# EAGLE schematic torque_sensor (EAGLE 9.5.2)
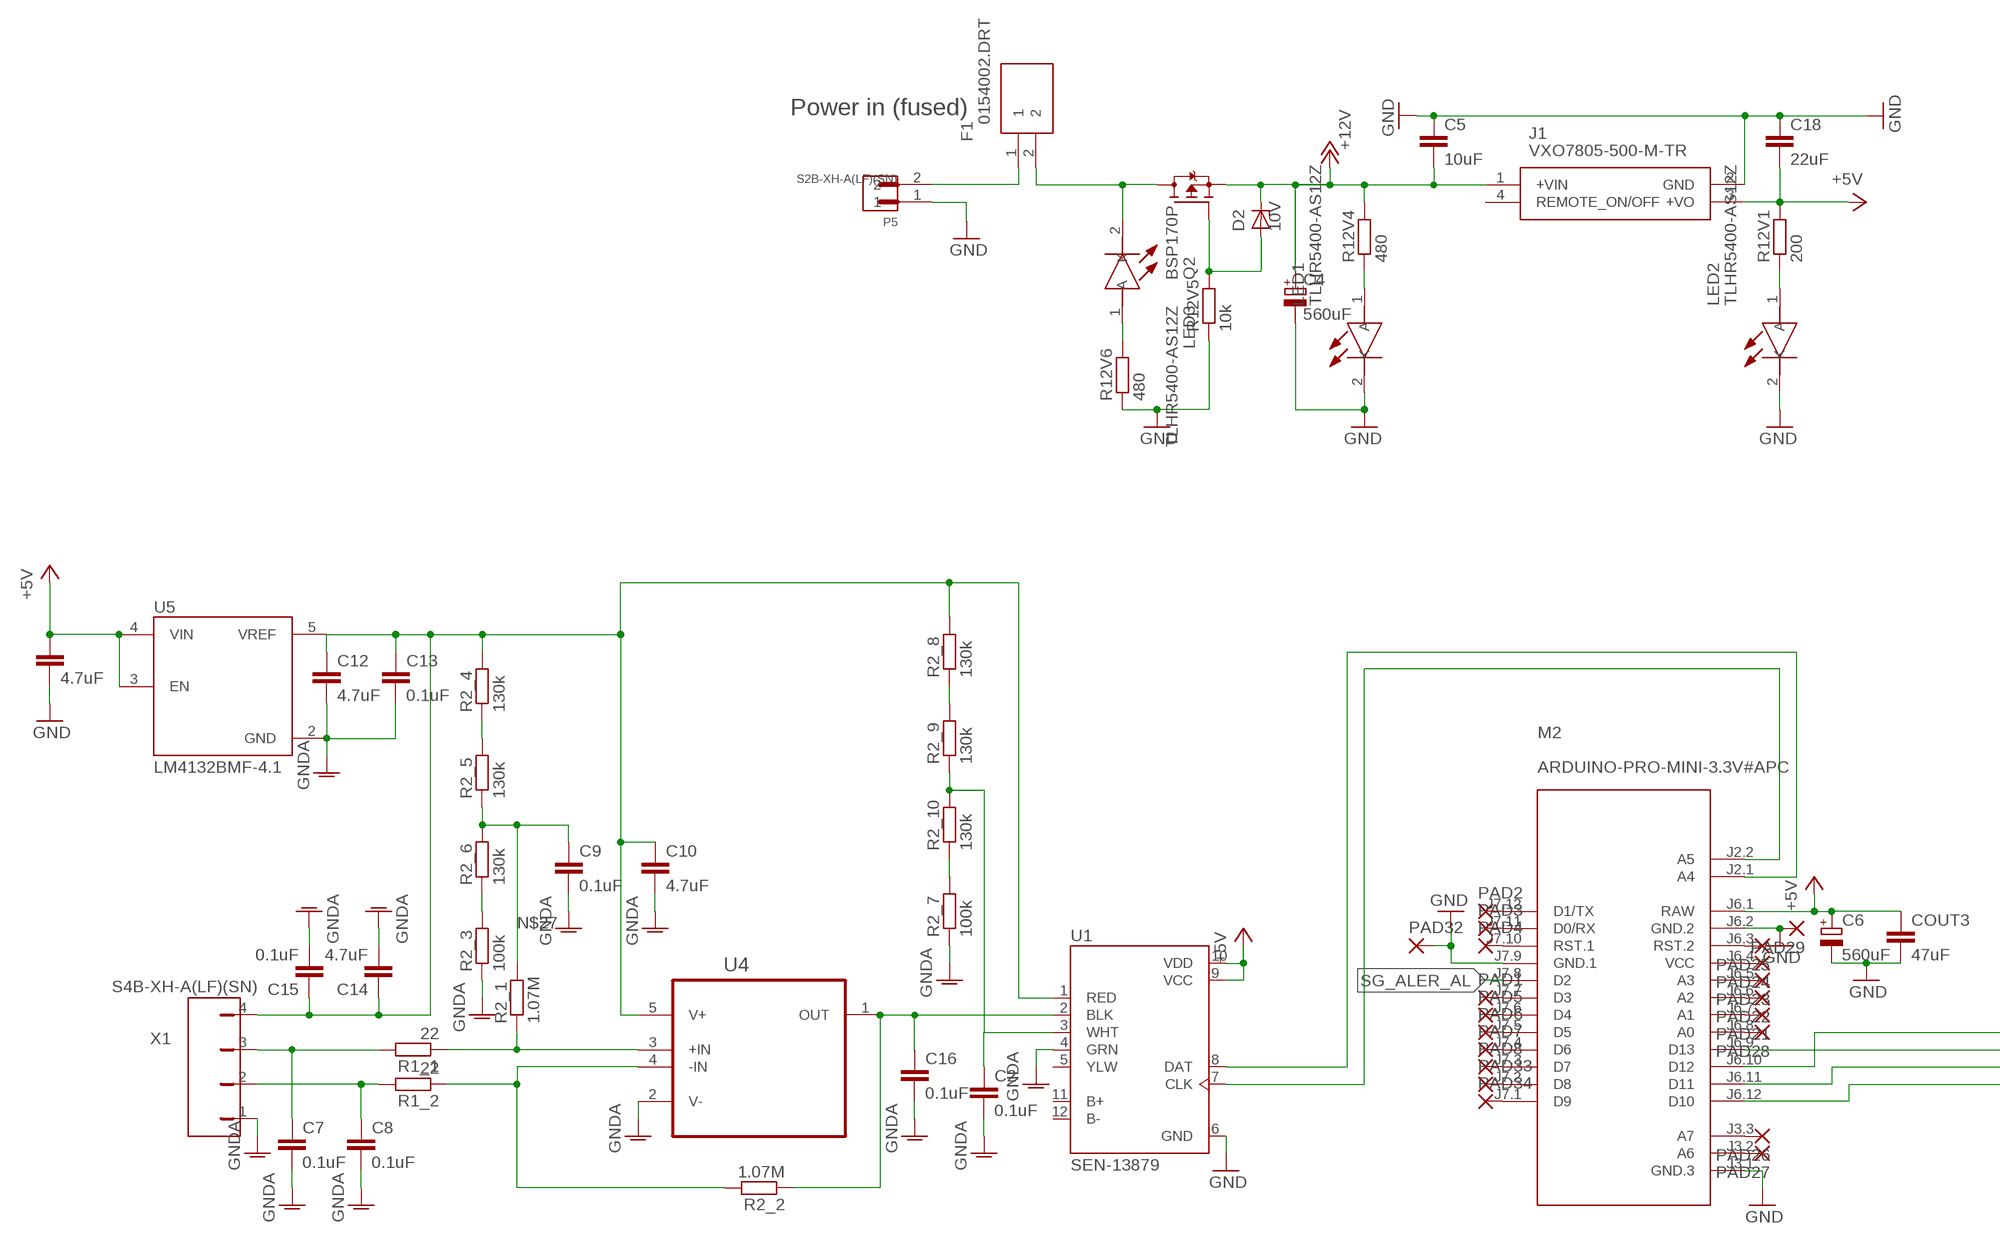
[diagram p0: schematic, sheet 1, part 1 of 2]
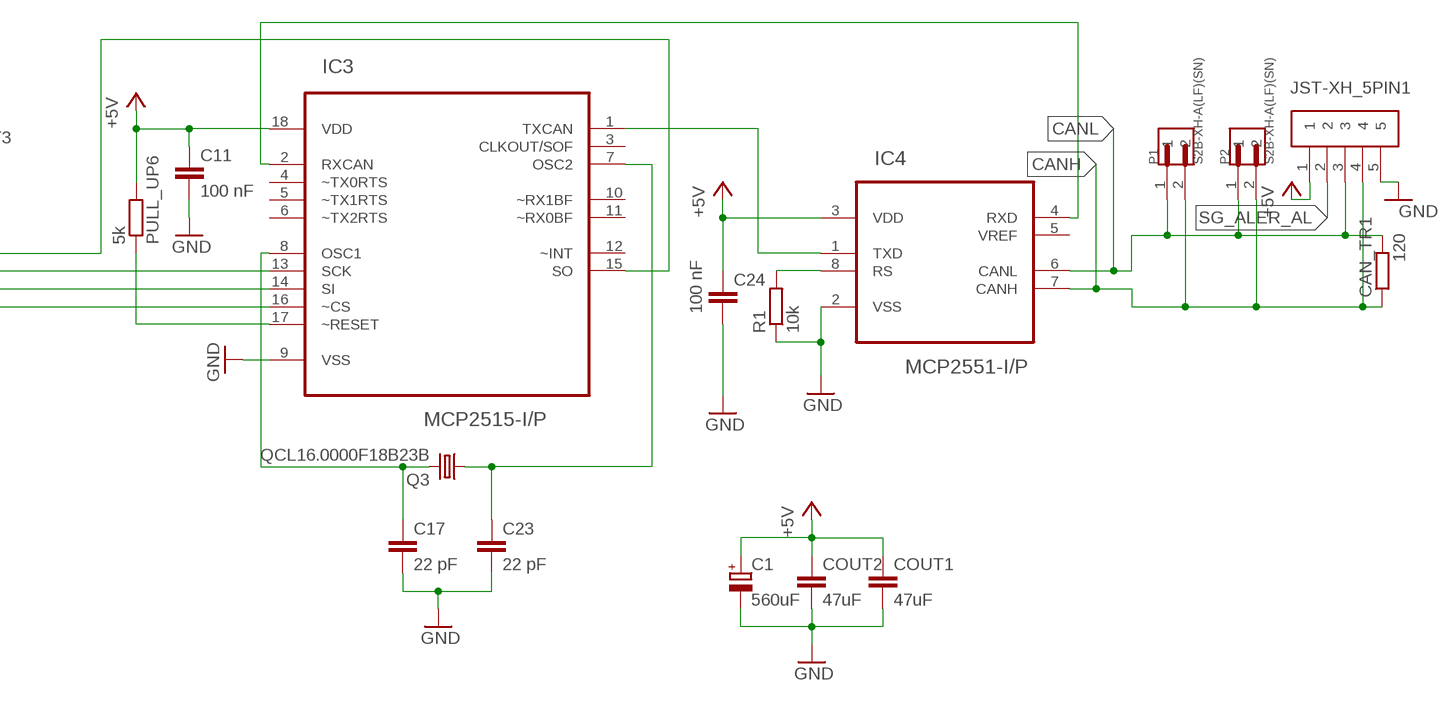
[diagram p1: schematic, sheet 1, part 2 of 2]

## Parts
C1  560uF  CPOL-EUF  [PANASONIC_F]
C2  0.1uF  C-EUC0805  [C0805]
C3  4.7uF  C-EUC0805  [C0805]
C4  560uF  CPOL-EUF  [PANASONIC_F]
C5  10uF  C-EUC0805  [C0805]
C6  560uF  CPOL-EUF  [PANASONIC_F]
C7  0.1uF  C-EUC0805  [C0805]
C8  0.1uF  C-EUC0805  [C0805]
C9  0.1uF  C-EUC0805  [C0805]
C10  4.7uF  C-EUC0805  [C0805]
C11  100 nF  C-EUC0805  [C0805]
C12  4.7uF  C-EUC0805  [C0805]
C13  0.1uF  C-EUC0805  [C0805]
C14  4.7uF  C-EUC0805  [C0805]
C15  0.1uF  C-EUC0805  [C0805]
C16  0.1uF  C-EUC0805  [C0805]
C17  22 pF  C-EUC0805  [C0805]
C18  22uF  C-EUC0805  [C0805]
C23  22 pF  C-EUC0805  [C0805]
C24  100 nF  C-EUC0805  [C0805]
CAN_TR1  120  R-EU_R0805  [R0805]
COUT1  47uF  C-EUC0805  [C0805]
COUT2  47uF  C-EUC0805  [C0805]
COUT3  47uF  C-EUC0805  [C0805]
D2  10V  ZENER-DIODESMB  [SMB]
F1  0154002.DRT  [FUSM9750X381N]
IC3  MCP2515-I/P  [DIP254P762X432-18]
IC4  MCP2551-I/P  [DIP254P762X432-8]
J1  VXO7805-500-M-TR  [VXO7805500MTR]
JST-XH_5PIN1  S5B-XH-A(LF)(SN)  [JST_S5B-XH-A(LF)(SN)]
LED1  TLHR5400-AS12Z  [TLHR5400AS12Z]
LED2  TLHR5400-AS12Z  [TLHR5400AS12Z]
LED3  TLHR5400-AS12Z  [TLHR5400AS12Z]
M2  ARDUINO-PRO-MINI-3.3V#APC  [ARDUINO-PRO-MINI#APC]
P1  S2B-XH-A(LF)(SN)  [JST_S2B-XH-A(LF)(SN)]
P2  S2B-XH-A(LF)(SN)  [JST_S2B-XH-A(LF)(SN)]
P5  S2B-XH-A(LF)(SN)  [JST_S2B-XH-A(LF)(SN)]
PAD1  SMD2  [SMD1,27-2,54]
PAD2  SMD2  [SMD1,27-2,54]
PAD3  SMD2  [SMD1,27-2,54]
PAD4  SMD2  [SMD1,27-2,54]
PAD5  SMD2  [SMD1,27-2,54]
PAD6  SMD2  [SMD1,27-2,54]
PAD7  SMD2  [SMD1,27-2,54]
PAD8  SMD2  [SMD1,27-2,54]
PAD21  SMD2  [SMD1,27-2,54]
PAD22  SMD2  [SMD1,27-2,54]
PAD23  SMD2  [SMD1,27-2,54]
PAD24  SMD2  [SMD1,27-2,54]
PAD25  SMD2  [SMD1,27-2,54]
PAD26  SMD2  [SMD1,27-2,54]
PAD27  SMD2  [SMD1,27-2,54]
PAD28  SMD2  [SMD1,27-2,54]
PAD29  SMD2  [SMD1,27-2,54]
PAD32  SMD2  [SMD1,27-2,54]
PAD33  SMD2  [SMD1,27-2,54]
PAD34  SMD2  [SMD1,27-2,54]
PULL_UP6  5k  R-EU_R0805  [R0805]
Q2  BSP170P  [SOT223]
Q3  QCL16.0000F18B23B  CRYSTALHC49S  [HC49/S]
R1  10k  R-EU_R0805  [R0805]
R1_1  22  R-EU_R0805  [R0805]
R1_2  22  R-EU_R0805  [R0805]
R2_1  1.07M  R-EU_R0805  [R0805]
R2_2  1.07M  R-EU_R0805  [R0805]
R2_3  100k  R-EU_R0805  [R0805]
R2_4  130k  R-EU_R0805  [R0805]
R2_5  130k  R-EU_R0805  [R0805]
R2_6  130k  R-EU_R0805  [R0805]
R2_7  100k  R-EU_R0805  [R0805]
R2_8  130k  R-EU_R0805  [R0805]
R2_9  130k  R-EU_R0805  [R0805]
R2_10  130k  R-EU_R0805  [R0805]
R12V1  200  R-EU_R0805  [R0805]
R12V4  480  R-EU_R0805  [R0805]
R12V5  10k  R-EU_R0805  [R0805]
R12V6  480  R-EU_R0805  [R0805]
U1  SEN-13879  [SPARKFUN_SEN-13879]
U4  LMP7731MF  [SOT95P284X119-5N]
U5  LM4132BMF-4.1  [SOT95P280X145-5N]
X1  S4B-XH-A(LF)(SN)  [S4B-XH-A(LF)(SN)]

## Nets
+5V [signal]: C1.+ C3.1 C6.+ C11.1 C18.2 C24.1 COUT1.1 COUT2.1 COUT3.1 IC3.18(VDD) IC4.3(VDD) J1.3(+VO) JST-XH_5PIN1.1 M2.J6.1(RAW) PULL_UP6.2 R12V1.2 U1.9(VCC) U1.10(VDD) U5.3(EN) U5.4(VIN)
+12V [12V]: C5.2 J1.1(+VIN) R12V4.2
CANH: CAN_TR1.1 IC4.7(CANH) JST-XH_5PIN1.4 P1.2 P2.2
CANL: CAN_TR1.2 IC4.6(CANL) JST-XH_5PIN1.3 P1.1 P2.1
GND: C1.- C3.2 C4.- C5.1 C6.- C11.2 C17.2 C18.1 C23.2 C24.2 COUT1.2 COUT2.2 COUT3.2 IC3.9(VSS) IC4.2(VSS) J1.2(GND) JST-XH_5PIN1.5 LED1.2(K) LED2.2(K) M2.J3.1(GND.3) M2.J6.2(GND.2) M2.J7.9(GND.1) P5.1 PAD29.1(P) PAD32.1(P) R1.1 R12V5.1 R12V6.1 U1.6(GND)
GNDA: C2.2 C7.2 C8.2 C9.2 C10.2 C12.2 C13.2 C14.2 C15.2 C16.2 R2_3.1 R2_7.1 U1.4(GRN) U4.2(V-) U5.2(GND) X1.1
N$1: R2_8.1 R2_9.2
N$2: LED2.1(A) R12V1.1
N$3: LED1.1(A) R12V4.1
N$4: C16.1 R2_2.1 U1.2(BLK) U4.1(OUT)
N$5: R1_2.1 R2_2.2 U4.4(-IN)
N$6: M2.J7.12(D1/TX) PAD2.1(P)
N$7: C8.1 R1_2.2 X1.2
N$8: R2_7.2 R2_10.1
N$9: C2.1
N$10: R2_9.1 R2_10.2 U1.3(WHT)
N$11: M2.J7.7(D3) PAD1.1(P)
N$12: M2.J7.6(D4) PAD5.1(P)
N$13: M2.J7.5(D5) PAD6.1(P)
N$14: M2.J7.4(D6) PAD7.1(P)
N$15: R1_1.1 R2_1.1 U4.3(+IN)
N$17: M2.J2.2(A5) U1.7(CLK)
N$18: M2.J7.3(D7) PAD8.1(P)
N$19: M2.J7.11(D0/RX) PAD3.1(P)
N$20 [12V]: D2.A Q2.1(G) R12V5.2
N$21: M2.J2.1(A4) U1.8(DAT)
N$22: F1.1 P5.2
N$23: M2.J7.10(RST.1) PAD4.1(P)
N$24: F1.2 LED3.2(K) Q2.2(D) Q2.4(D)
N$25: M2.J6.7(A1) PAD21.1(P)
N$26: M2.J6.6(A2) PAD22.1(P)
N$27: C9.1 R2_1.2 R2_5.1 R2_6.2
N$28: M2.J6.5(A3) PAD23.1(P)
N$29: M2.J6.4(VCC) PAD24.1(P)
N$30: M2.J6.3(RST.2) PAD25.1(P)
N$31: M2.J3.3(A7) PAD26.1(P)
N$33: C10.1 C12.1 C13.1 C14.1 C15.1 R2_4.2 R2_8.2 U1.1(RED) U4.5(V+) U5.5(VREF) X1.4
N$34: M2.J7.2(D8) PAD33.1(P)
N$35: R2_4.1 R2_5.2
N$36: IC3.15(SO) M2.J6.10(D12)
N$37: IC3.13(SCK) M2.J6.9(D13)
N$38: IC3.14(SI) M2.J6.11(D11)
N$39: IC3.16(~CS) M2.J6.12(D10)
N$40: M2.J3.2(A6) PAD27.1(P)
N$41: M2.J6.8(A0) PAD28.1(P)
N$45: LED3.1(A) R12V6.2
N$54: R2_3.2 R2_6.1
N$55: M2.J7.1(D9) PAD34.1(P)
N$56: IC3.17(~RESET) PULL_UP6.1
N$58: C17.1 IC3.8(OSC1) Q3.2
N$59: C23.1 IC3.7(OSC2) Q3.1
N$60: IC4.8(RS) R1.2
N$62: IC3.2(RXCAN) IC4.4(RXD)
N$68: IC3.1(TXCAN) IC4.1(TXD)
N$84 [12V]: C4.+ D2.C Q2.3(S)
SG_ALER_AL: JST-XH_5PIN1.2 M2.J7.8(D2)
VCCINT4: C7.1 R1_1.2 X1.3
Unconnected: IC3.3(CLKOUT/SOF) IC3.4(~TX0RTS) IC3.5(~TX1RTS) IC3.6(~TX2RTS) IC3.10(~RX1BF) IC3.11(~RX0BF) IC3.12(~INT) IC4.5(VREF) J1.4(REMOTE_ON/OFF) U1.5(YLW) U1.11(B+) U1.12(B-)

## Notes on the sheet
- Power in (fused)

## Library data of the parts
C1 C4 C6 = rcl:CPOL-EU: POLARIZED CAPACITOR, European symbol; SPICEPREFIX: C
C2 C3 C5 C7-C18 C23 C24 COUT1-COUT3 = rcl:C-EU: CAPACITOR, European symbol; SPICEPREFIX: C
CAN_TR1 PULL_UP6 R1 R1_1 R1_2 R2_1-R2_10 R12V1 R12V4-R12V6 = rcl:R-EU_: RESISTOR, European symbol; SPICEPREFIX: R
D2 = diode:ZENER-DIODE: Z-Diode
F1 = 0154002.DRT:0154002.DRT: Littelfuse 2A T Surface Mount Fuse, 125V ac/dc Source: Datasheet; DESCRIPTION: Littelfuse 2A T Surface Mount Fuse, 125V ac/dc; HEIGHT: 3.81mm; MANUFACTURER_NAME: LITTELFUSE; MANUFACTURER_PART_NUMBER: 0154002.DRT; MOUSER_PART_NUMBER: 576-0154002.DRT; MOUSER_PRICE-STOCK: https://www.mouser.co.uk/ProductDetail/Littelfuse/0154002DRT?qs=2VFNtWizgicDQ8R7JxIsmA%3D%3D
IC3 = MCP2515-I_P:MCP2515-I/P: Stand-Alone CAN Controller; AVAILABILITY: Unavailable; DESCRIPTION: MCP2515 Series 5.5 V 1 Mb/s Stand Alone SPI Interface CAN Controller - PDIP-18; MF: Microchip; MP: MCP2515-I/P; PACKAGE: DIP-18 Microchip; PRICE: None
IC4 = MCP2551-I_P:MCP2551-I/P: High-Speed CAN Transceiver; AVAILABILITY: Unavailable; DESCRIPTION: MCP2551 Series 5.5 V 1 Mb/s Surface Mount High-Speed CAN Transceiver - PDIP-8; MF: Microchip; MP: MCP2551-I/P; PACKAGE: DIP-8 Microchip; PRICE: None
J1 = VXO7805-500-M-TR:VXO7805-500-M-TR: Module DC-DC 24VIN 1-OUT 5V 0.5A 2.5W 4-Pin SMD Module T/R Source: Datasheet; DESCRIPTION: Module DC-DC 24VIN 1-OUT 5V 0.5A 2.5W 4-Pin SMD Module T/R; HEIGHT: 3.5mm; MANUFACTURER_NAME: CUI Inc; MANUFACTURER_PART_NUMBER: VXO7805-500-M-TR; MOUSER_PART_NUMBER: 490-VXO7805-500-M-TR; MOUSER_PRICE-STOCK: https://www.mouser.co.uk/ProductDetail/CUI-Inc/VXO7805-500-M-TR?qs=GBLSl2AkirsIOUn2Flq1hQ%3D%3D
JST-XH_5PIN1 = S5B-XH-A_LF__SN_:S5B-XH-A(LF)(SN): XH Connector 2.5mm pitch/Disconnectable Crimp Style Connector; AVAILABILITY: Unavailable; DESCRIPTION: Connector Header Through Hole, Right Angle 5 position 0.098 _2.50mm_; MF: JST Sales; MP: S5B-XH-A_LF__SN_; PACKAGE: None; PRICE: None
LED1-LED3 = SamacSys_Parts:TLHR5400-AS12Z: Standard LEDs - Through Hole Red 10mcd; 5mm 612-625nm; 2V Typ Source: Datasheet <http://www.vishay.com/docs/83012/tlhg540.pdf>; DESCRIPTION: Standard LEDs - Through Hole Red 10mcd; 5mm 612-625nm; 2V Typ; HEIGHT: 12.8mm; MANUFACTURER_NAME: Vishay; MANUFACTURER_PART_NUMBER: TLHR5400-AS12Z; MOUSER_PART_NUMBER: 78-TLHR5400-AS12Z; MOUSER_PRICE-STOCK: https://www.mouser.co.uk/ProductDetail/Vishay-Semiconductors/TLHR5400-AS12Z?qs=nQ9vpdMXC6Dc4iRzpr4t7Q%3D%3D
M2 = diy-modules:ARDUINO-PRO-MINI-*#APC: Arduino Pro Mini (and compatible devices) with angle programming connector More details available here: https://www.arduino.cc/en/Main/ArduinoBoardProMini Click here to find device on ebay.com <http://www.ebay.com/sch/arduino+pro+mini>
P1 P2 P5 = S2B-XH-A_LF__SN_:S2B-XH-A(LF)(SN): XH Series 2.5mm 2 Position Through Hole Shrouded Header Connector; DESCRIPTION: Connector Header Through Hole, Right Angle 2 position 0.098 _2.50mm_; DIGI-KEY_PART_NUMBER: 455-2257-ND; DIGI-KEY_PURCHASE_URL: https://www.digikey.com/product-detail/en/jst-sales-america-inc/S2B-XH-A_LF__SN_/455-2257-ND/1651055?utm_source=snapeda&utm_medium=aggregator&utm_campaign=symbol; MF: JST Sales; MP: S2B-XH-A_LF__SN_; PACKAGE: None
PAD1-PAD8 PAD21-PAD29 PAD32-PAD34 = wirepad:SMD2: SMD PAD
Q2 = transistor-fet:BSP170P: SIPMOS(R) Small-Signal-Transistor P-Channel, Enhancement mode Source: http://www.infineon.com/upload/Document/BSP170P_Rev2.4.pdf
Q3 = adafruit:CRYSTAL: CRYSTAL; OC_FARNELL: 1667008; OC_NEWARK: unknown
U1 = SEN-13879:SEN-13879: Load Cell Amp Hx711; DESCRIPTION: External Input Sensor Amplifier; DIGI-KEY_PART_NUMBER: 1568-1436-ND; DIGI-KEY_PURCHASE_URL: https://www.digikey.com/product-detail/en/sparkfun-electronics/SEN-13879/1568-1436-ND/6202732?utm_source=snapeda&utm_medium=aggregator&utm_campaign=symbol; MF: SparkFun; MP: SEN-13879; PACKAGE: None
U4 = LMP7731MF:LMP7731MF: Amplifier; AVAILABILITY: Unavailable; DESCRIPTION: Ic Amp Prec Rrio Ln Sgl Sot23-5 - Lmp7731mf/Nopb; MF: Texas Instruments; MP: LMP7731MF; PACKAGE: SOT-23 Texas Instruments; PRICE: None
U5 = LM4132BMF-4.1:LM4132BMF-4.1: Voltage Reference, Precision, Low Dropout, Series - Fixed, LM4132 Series, 4.096V, SOT-23-5; AVAILABILITY: Unavailable; DESCRIPTION: Series Voltage Reference IC ±0.1% SOT-23-5; MF: Texas Instruments; MP: LM4132BMF-4.1; PACKAGE: SOT-23 Texas Instruments; PRICE: None
X1 = S4B-XH-A_LF__SN_:S4B-XH-A(LF)(SN): http://octopart.com/s4b-xh-a%28lf%29%28sn%29-jst-7995347; AVAILABILITY: Unavailable; DESCRIPTION: Connector Header Through Hole, Right Angle 4 position 0.098 _2.50mm_; MF: JST Sales; MP: S4B-XH-A_LF__SN_; PACKAGE: None; PRICE: None

## Net classes
1 signal: width 0.3 mm, drill 0.4 mm, clearance 0.25 mm
2 12V: width 1 mm, drill 1.1 mm, clearance 0.25 mm